# Altium schematic sheet DDMTD.SchDoc: Sayma AMC
size 420 x 297 mm; CheckedBy: P.Kulik,T.Przywozki,W.Ruclo; Author: G.Kasprowicz; CompanyName: WUT ISE; DrawnBy: G.Kasprowicz; Organization: WUT ISE; Address1: PW ISE; Address2: Nowowiejska 15/19 00-665 Warsaw; Address3: gkasprow@gmail.com; DocumentNumber: 18; Revision: 2; SheetNumber: 18; SheetTotal: 32; ModifiedBy: -; CheckedDate: -; Title2: WR DDMTD; DivGrp: WUT ISE; Designer: G.Kasprowicz; ModifiedDate: -; ProjectName: Sensor Box
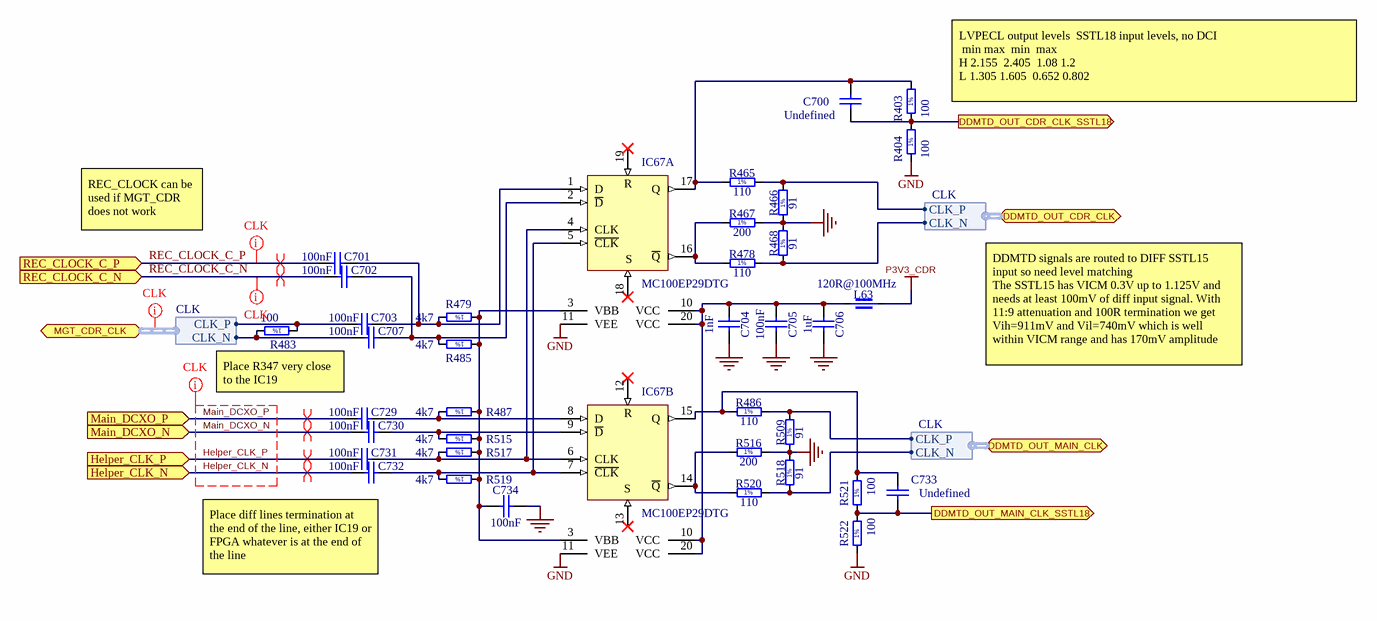
[diagram p0: DDMTD.SchDoc]

## Parts
C700  Undefined  [CAPC1005X55N]
C701  100nF  [CAPC1005X55N]
C702  100nF  [CAPC1005X55N]
C703  100nF  [CAPC1005X55N]
C704  1nF  [CAPC0603X33N]
C705  100nF  [CAPC0603X33N]
C706  1uF  [CAPC1005X55N]
C707  100nF  [CAPC1005X55N]
C729  100nF  [CAPC1005X55N]
C730  100nF  [CAPC1005X55N]
C731  100nF  [CAPC1005X55N]
C732  100nF  [CAPC1005X55N]
C733  Undefined  [CAPC1005X55N]
C734  100nF  [CAPC0603X33N]
IC67  MC100EP29DTG  [SOP65P640X120-20N]  (parts A,B of 2)
L63  120R@100MHz  [INDC1608X95N]
R403  100  [RESC1005X40N]
R404  100  [RESC1005X40N]
R465  110  [RESC1005X40N]
R466  91  [RESC1005X40N]
R467  200  [RESC1005X40N]
R468  91  [RESC1005X40N]
R478  110  [RESC1005X40N]
R479  4k7  [RESC1005X40N]
R483  100  [RESC1005X40N]
R485  4k7  [RESC1005X40N]
R486  110  [RESC1005X40N]
R487  4k7  [RESC1005X40N]
R509  91  [RESC1005X40N]
R515  4k7  [RESC1005X40N]
R516  200  [RESC1005X40N]
R517  4k7  [RESC1005X40N]
R518  91  [RESC1005X40N]
R519  4k7  [RESC1005X40N]
R520  110  [RESC1005X40N]
R521  100  [RESC1005X40N]
R522  100  [RESC1005X40N]

## Ports
DDMTD_OUT_CDR_CLK (bidir, harness CLK), DDMTD_OUT_CDR_CLK_SSTL18 (out), DDMTD_OUT_MAIN_CLK (bidir, harness CLK), DDMTD_OUT_MAIN_CLK_SSTL18 (out), Helper_CLK_N (in), Helper_CLK_P (in), Main_DCXO_N (in), Main_DCXO_P (in), MGT_CDR_CLK (bidir, harness CLK), REC_CLOCK_C_N (in), REC_CLOCK_C_P (in)

## Harnesses
CLK: CLK_N, CLK_P

## Nets
GND: C704.1 C705.1 C706.2 C734.1 IC67.11(VEE) R404.1 R466.1 R467.2 R468.2 R509.1 R516.2 R518.2 R522.1
P3V3_CDR: L63.1
DDMTD_OUT_CDR_CLK_SSTL18: C700.1 R403.1 R404.2 ; port DDMTD_OUT_CDR_CLK_SSTL18
DDMTD_OUT_MAIN_CLK_SSTL18: C733.1 R521.1 R522.2 ; port DDMTD_OUT_MAIN_CLK_SSTL18
Helper_CLK_N: C732.1 ; port Helper_CLK_N
Helper_CLK_P: C731.1 ; port Helper_CLK_P
Main_DCXO_N: C730.1 ; port Main_DCXO_N
Main_DCXO_P: C729.1 ; port Main_DCXO_P
REC_CLOCK_C_N: C702.1 ; port REC_CLOCK_C_N
REC_CLOCK_C_P: C701.1 ; port REC_CLOCK_C_P
NetC700_2: C700.2 IC67.17(Q) R403.2 R465.1
NetC701_2: C701.2 C703.2 IC67.1(D) R479.2
NetC702_2: C702.2 C707.2 IC67.2(~{D}) R485.2
NetC703_1: C703.1 R483.1 ; port MGT_CDR_CLK.CLK_P
NetC704_2: C704.2 C705.2 C706.1 IC67.10(VCC) IC67.20(VCC) L63.2
NetC707_1: C707.1 R483.2 ; port MGT_CDR_CLK.CLK_N
NetC729_2: C729.2 IC67.8(D) R487.2
NetC730_2: C730.2 IC67.9(~{D}) R515.2
NetC731_2: C731.2 IC67.4(CLK) IC67.6(CLK) R517.2
NetC732_2: C732.2 IC67.5(~{CLK}) IC67.7(~{CLK}) R519.2
NetC733_2: C733.2 IC67.15(Q) R486.1 R521.2
NetC734_2: C734.2 IC67.3(VBB) R479.1 R485.1 R487.1 R515.1 R517.1 R519.1
NetIC67_14: IC67.14(~{Q}) R516.1 R520.1
NetIC67_16: IC67.16(~{Q}) R467.1 R478.1
NetR465_2: R465.2 R466.2 ; port DDMTD_OUT_CDR_CLK.CLK_P
NetR468_1: R468.1 R478.2 ; port DDMTD_OUT_CDR_CLK.CLK_N
NetR486_2: R486.2 R509.2 ; port DDMTD_OUT_MAIN_CLK.CLK_P
NetR518_1: R518.1 R520.2 ; port DDMTD_OUT_MAIN_CLK.CLK_N

Not connected (* = marked no-connect by the designer): IC67 12(R)* 13(S)* 18(S)* 19(R)*

## Layout directives
differential pair: Helper_CLK_N, Helper_CLK_P, Main_DCXO_N, Main_DCXO_P, REC_CLOCK_C_N, REC_CLOCK_C_P
net class CLK: (no net found under the mark), Helper_CLK_N, Helper_CLK_P, Main_DCXO_N, Main_DCXO_P, REC_CLOCK_C_N, REC_CLOCK_C_P

## Notes on the sheet
- LVPECL output levels		SSTL18 input levels, no DCI
  min	max		min	 max
  H	2.155 	2.405		1.08	1.2
  L	1.305	1.605		0.652	0.802
- REC_CLOCK can be used if MGT_CDR does not work
- DDMTD signals are routed to DIFF SSTL15 input so need level matching
  The SSTL15 has VICM 0.3V up to 1.125V and needs at least 100mV of diff input signal. With 11:9 attenuation and 100R termination we get Vih=911mV and Vil=740mV which is well within VICM range and has 170mV amplitude
- Place R347 very close  to the IC19
- Place diff lines termination at the end of the line, either IC19 or FPGA whatever is at the end of the line
- Project/Equipment
- Document
- Designer
- Drawn by
- Check.by
- Copyright WUT ISE 2018.
  This documentation describes Open Hardware and is licensed under the CERN OHL v.1.1. You may redistribute and modify this documentation under the terms of the CERN OHL v.1.1. (http://ohwr.org/CERNOHL). This documentation is distributed WITHOUT ANY EXPRESS OR IMPLIED WARRANTY, INCLUDING OF MERCHANTABILITY, SATISFACTORY QUALITY AND FITNESS FOR A PARTICULAR PURPOSE. Please see the CERN OHL v.1.1 for applicable conditions.
- Contact
- File
- Last Mod.
- Print Date
- Sheet
- Size
- A3
- of
- Rev
- (in symbol R0402_4K7_1%_0.0625W_100PPM) 1%
- (in symbol R0402_91R_1%_0.0625W_100PPM) 1%
- (in symbol R0402_100R_1%_0.0625W_100PPM) 1%
- (in symbol R0402_110R_1%_0.0625W_100PPM) 1%
- (in symbol R0402_200R_1%_0.0625W_100PPM) 1%

## Library data of the parts
C700 C733 = CC0402_NO-VALUE: Non-polarised capacitor; Part Description: Reserved Footprint For 0402(1005) Chip Ceramic Capacitor; Mounted: No; Part Number: CC0402_NO-VALUE; Component Kind: Standard; Component Type: Standard; Pin Count: 2; Value: Undefined; Status: None; Manufacturer: Undefined; Manufacturer Part Number: CC0402_NO-VALUE; Case: 0402; Socket: No; SMD: Yes; Sense: No; Manufacturer1 ComponentHeight: 0.55mm; HelpURL: Undefined; Author: CERN DEM JLC; CreateDate: 14.01.2014; LatestRevisionDate: 14.01.2014
C701-C703 C707 C729-C732 = CC0402_100NF_16V_10%_X5R: Non-polarised capacitor; Manufacturer: GENERIC; Manufacturer1 Part Number: GRM155R61C104KA88D; Part Description: SMD Multilayer Chip Ceramic Capacitor; TC: X5R; Tolerance: ±10%; Voltage: 16V; Case: 0402; Manufacturer Part Number: CC0402_100NF_16V_10%_X5R; Manufacturer1 Example: MURATA; Part Number: CC0402_100NF_16V_10%_X5R; Pin Count: 2; SMD: Yes; Status: None; Value: 100nF; Component Kind: Standard; Component Type: Standard; Mounted: Yes; Socket: No; Sense: No; Manufacturer1 ComponentHeight: 0.55mm; HelpURL: \\cern.ch\dfs\Applications\Altium\Datasheets\CC0402_X5R_MURATA_GRM.pdf; Author: CERN DEM JLC; CreateDate: 10.12.2013; LatestRevisionDate: 10.12.2013
C704 = CC0201_1NF_16V_10%_X5R: Non-polarised capacitor; Manufacturer: GENERIC; Part Description: SMD Multilayer Chip Ceramic Capacitor; Manufacturer1 Part Number: 0201YD102KAT2A; Tolerance: ±10%; Voltage: 16V; TC: X5R; Manufacturer Part Number: CC0201_1NF_16V_10%_X5R; Part Number: CC0201_1NF_16V_10%_X5R; Value: 1nF; Component Kind: Standard; Component Type: Standard; Pin Count: 2; Status: Not Recommended; Case: 0201; Mounted: Yes; Socket: No; SMD: Yes; Sense: No; Manufacturer1 Example: AVX; Manufacturer1 ComponentHeight: 0.33mm; HelpURL: \\cern.ch\dfs\Applications\Altium\Datasheets\CC0201_X5R_AVX.pdf; Author: CERN DEM JLC; CreateDate: 03.12.2007; LatestRevisionDate: 03.12.2007
C705 C734 = CC0201_100NF_6.3V_10%_X5R: Non-polarised capacitor; Manufacturer: GENERIC; Part Description: SMD Multilayer Chip Ceramic Capacitor; Manufacturer1 Part Number: 02016D104KAT2A; Tolerance: ±10%; Voltage: 6.3V; TC: X5R; Manufacturer Part Number: CC0201_100NF_6.3V_10%_X5R; Part Number: CC0201_100NF_6.3V_10%_X5R; Value: 100nF; Component Kind: Standard; Component Type: Standard; Pin Count: 2; Status: Not Recommended; Case: 0201; Mounted: Yes; Socket: No; SMD: Yes; Sense: No; Manufacturer1 Example: AVX; Manufacturer1 ComponentHeight: 0.33mm; HelpURL: \\cern.ch\dfs\Applications\Altium\Datasheets\CC0201_X5R_AVX.pdf; Author: CERN DEM JLC; CreateDate: 03.12.2007; LatestRevisionDate: 03.12.2007
C706 = CC0402_1UF_16V_10%_X5R: Non-polarised capacitor; Manufacturer: GENERIC; Part Description: SMD Multilayer Chip Ceramic Capacitor; Manufacturer1 Part Number: C1005X5R1C105KT; Tolerance: ±10%; Voltage: 16V; TC: X5R; Manufacturer Part Number: CC0402_1UF_16V_10%_X5R; Part Number: CC0402_1UF_16V_10%_X5R; Value: 1uF; Component Kind: Standard; Component Type: Standard; Pin Count: 2; Status: Preferred; Case: 0402; Mounted: Yes; Socket: No; SMD: Yes; Sense: No; Manufacturer1 Example: TDK; Manufacturer1 ComponentHeight: 0.55mm; HelpURL: \\cern.ch\dfs\Applications\Altium\Datasheets\CC0402_X5R_TDK_C.pdf; Author: CERN DEM JLC; CreateDate: 25.10.2012; LatestRevisionDate: 25.10.2012
IC67 = MC100EP29DTG: 3.3V/5V ECL Dual Differential Data and Clock D Flip-Flop With Set and Reset; Manufacturer: ON SEMICONDUCTOR; PressFit: No; Bonding: No; Part Number: MC100EP29DTG; Component Kind: Standard; Component Type: Standard; Device: MC100EP29DTG; PackageDescription: SOP, 20-Leads, Body 6.5x4.4mm, Pitch 0.65mm, IPC Medium Density; Part Description: 3.3V/5V ECL Dual Differential Data And Clock D Flip-Flop With Set and Reset; Manufacturer Part Number: MC100EP29DTG; Pin Count: 20; Case: TSSOP20; Mounted: Yes; Socket: No; SMD: Yes; Sense: No; ComponentHeight: 1.2mm; Author: CERN DEM JLC; HelpURL: \\cern.ch\dfs\Applications\Altium\Datasheets\MC100EP29DTG.pdf; CreateDate: 12.01.2011; LatestRevisionDate: 12.01.2011
L63 = IND0603_MURATA_BLM18PG121SN1D: Manufacturer: MURATA; Part Description: SMD EMIFIL Chip Ferrite Bead; Power: 2A; Resistance: 0.05R; Manufacturer Part Number: BLM18PG121SN1D; Part Number: IND0603_MURATA_BLM18PG121SN1D; Value: 120R@100MHz; Component Kind: Standard; Component Type: Standard; Pin Count: 2; Status: None; Case: 0603; Mounted: Yes; Socket: No; SMD: Yes; Sense: No; ComponentHeight: 0.95mm; HelpURL: \\cern.ch\dfs\Applications\Altium\Datasheets\IND0603_MURATA_BLM18P.pdf; Author: CERN DEM BC; CreateDate: 27.07.2015; LatestRevisionDate: 25.10.2018
R403 R404 R483 R521 R522 = R0402_100R_1%_0.0625W_100PPM: Resistor - 1%; Manufacturer: GENERIC; Part Description: General Purpose Thick Film Chip Resistor; Manufacturer1 Part Number: 232270671001L; TC: ±100ppm/°C; PressFit: No; Manufacturer Part Number: R0402_100R_1%_0.0625W_100PPM; Part Number: R0402_100R_1%_0.0625W_100PPM; Tolerance: ±1%; Value: 100; Component Kind: Standard; Component Type: Standard; Pin Count: 2; Status: Not Recommended; Power: 0.0625W; Case: 0402; Mounted: Yes; Sense: No; Socket: No; SMD: Yes; Manufacturer1 Example: YAGEO PHYCOMP; Manufacturer1 ComponentHeight: 0.4mm; HelpURL: \\cern.ch\dfs\Applications\Altium\Datasheets\R0402_Phycomp_RC0402.pdf; Author: CERN DEM JLC; CreateDate: 03.12.2007; LatestRevisionDate: 17.10.2012
R465 R478 R486 R520 = R0402_110R_1%_0.0625W_100PPM: Resistor - 1%; Manufacturer: GENERIC; Part Description: General Purpose Thick Film Chip Resistor; Manufacturer1 Part Number: 232270671101L; TC: ±100ppm/°C; PressFit: No; Manufacturer Part Number: R0402_110R_1%_0.0625W_100PPM; Part Number: R0402_110R_1%_0.0625W_100PPM; Tolerance: ±1%; Value: 110; Component Kind: Standard; Component Type: Standard; Pin Count: 2; Status: Not Recommended; Power: 0.0625W; Case: 0402; Mounted: Yes; Sense: No; Socket: No; SMD: Yes; Manufacturer1 Example: YAGEO PHYCOMP; Manufacturer1 ComponentHeight: 0.4mm; HelpURL: \\cern.ch\dfs\Applications\Altium\Datasheets\R0402_Phycomp_RC0402.pdf; Author: CERN DEM JLC; CreateDate: 03.12.2007; LatestRevisionDate: 17.10.2012
R466 R468 R509 R518 = R0402_91R_1%_0.0625W_100PPM: Resistor - 1%; Manufacturer: GENERIC; Part Description: General Purpose Thick Film Chip Resistor; Manufacturer1 Part Number: 232270679109L; TC: ±100ppm/°C; PressFit: No; Manufacturer Part Number: R0402_91R_1%_0.0625W_100PPM; Part Number: R0402_91R_1%_0.0625W_100PPM; Tolerance: ±1%; Value: 91; Component Kind: Standard; Component Type: Standard; Pin Count: 2; Status: Not Recommended; Power: 0.0625W; Case: 0402; Mounted: Yes; Sense: No; Socket: No; SMD: Yes; Manufacturer1 Example: YAGEO PHYCOMP; Manufacturer1 ComponentHeight: 0.4mm; HelpURL: \\cern.ch\dfs\Applications\Altium\Datasheets\R0402_Phycomp_RC0402.pdf; Author: CERN DEM JLC; CreateDate: 03.12.2007; LatestRevisionDate: 17.10.2012
R467 R516 = R0402_200R_1%_0.0625W_100PPM: Resistor - 1%; Part Description: General Purpose Thick Film Chip Resistor; Manufacturer: GENERIC; Manufacturer1 Part Number: 232270672001L; TC: ±100ppm/°C; PressFit: No; Part Number: R0402_200R_1%_0.0625W_100PPM; Component Kind: Standard; Component Type: Standard; Pin Count: 2; Value: 200; Status: Not Recommended; Power: 0.0625W; Tolerance: ±1%; Manufacturer Part Number: R0402_200R_1%_0.0625W_100PPM; Case: 0402; Mounted: Yes; Sense: No; Socket: No; SMD: Yes; Manufacturer1 Example: YAGEO PHYCOMP; Manufacturer1 ComponentHeight: 0.4mm; HelpURL: \\cern.ch\dfs\Applications\Altium\Datasheets\R0402_Phycomp_RC0402.pdf; Author: CERN DEM JLC; CreateDate: 03.12.2007; LatestRevisionDate: 17.10.2012
R479 R485 R487 R515 R517 R519 = R0402_4K7_1%_0.0625W_100PPM: Resistor - 1%; Manufacturer: GENERIC; Part Description: General Purpose Thick Film Chip Resistor; Manufacturer1 Part Number: 232270674702L; TC: ±100ppm/°C; PressFit: No; Manufacturer Part Number: R0402_4K7_1%_0.0625W_100PPM; Part Number: R0402_4K7_1%_0.0625W_100PPM; Tolerance: ±1%; Value: 4k7; Component Kind: Standard; Component Type: Standard; Pin Count: 2; Status: Not Recommended; Power: 0.0625W; Case: 0402; Mounted: Yes; Sense: No; Socket: No; SMD: Yes; Manufacturer1 Example: YAGEO PHYCOMP; Manufacturer1 ComponentHeight: 0.4mm; HelpURL: \\cern.ch\dfs\Applications\Altium\Datasheets\R0402_Phycomp_RC0402.pdf; Author: CERN DEM JLC; CreateDate: 03.12.2007; LatestRevisionDate: 17.10.2012